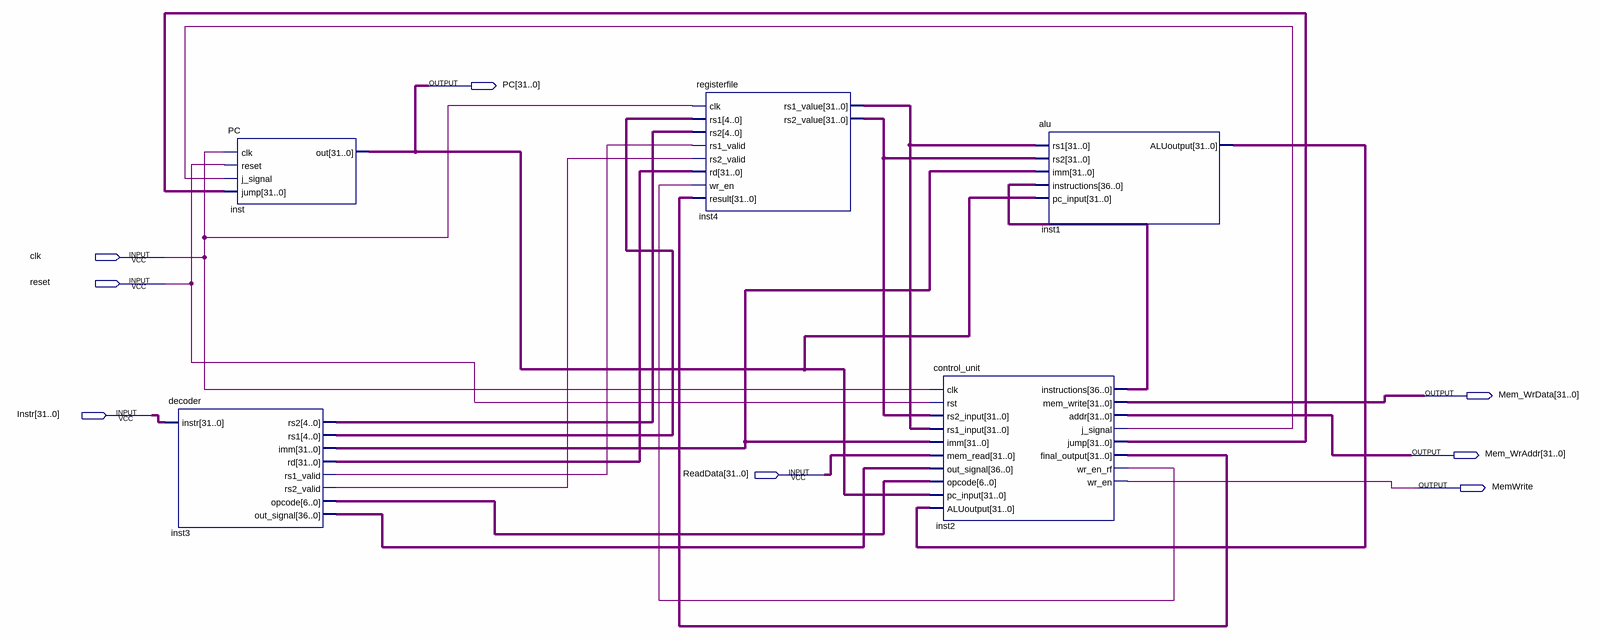
[diagram p0: schematic sheet]
// Quartus schematic riscv_cpu_block.bdf as structural Verilog: 5 symbols, 8 pins
module riscv_cpu_block (
  input  clk,
  input  reset,
  input  [31:0] Instr,
  input  [31:0] ReadData,
  output [31:0] PC,
  output [31:0] Mem_WrData,
  output [31:0] Mem_WrAddr,
  output MemWrite
);

  wire inst2_j_signal, inst2_wr_en_rf, inst3_rs1_valid, inst3_rs2_valid;
  wire [4:0] inst3_rs1, inst3_rs2;
  wire [6:0] inst3_opcode;
  wire [31:0] inst1_aluoutput, inst2_final_output, inst2_jump, inst3_imm, inst3_rd, inst4_rs1_value,
       inst4_rs2_value;
  wire [36:0] inst2_instructions, inst3_out_signal;

  decoder inst3 (
    .instr(Instr), .rs2(inst3_rs2), .rs1(inst3_rs1), .imm(inst3_imm), .rd(inst3_rd),
    .rs1_valid(inst3_rs1_valid), .rs2_valid(inst3_rs2_valid), .opcode(inst3_opcode),
    .out_signal(inst3_out_signal));
  PC inst (.clk(clk), .reset(reset), .j_signal(inst2_j_signal), .jump(inst2_jump), .out(PC));
  registerfile inst4 (
    .clk(clk), .rs1(inst3_rs1), .rs2(inst3_rs2), .rs1_valid(inst3_rs1_valid), .rs2_valid(inst3_rs2_valid),
    .rd(inst3_rd), .wr_en(inst2_wr_en_rf), .result(inst2_final_output), .rs1_value(inst4_rs1_value),
    .rs2_value(inst4_rs2_value));
  control_unit inst2 (
    .clk(clk), .rst(reset), .rs2_input(inst4_rs2_value), .rs1_input(inst4_rs1_value), .imm(inst3_imm),
    .mem_read(ReadData), .out_signal(inst3_out_signal), .opcode(inst3_opcode), .pc_input(PC),
    .ALUoutput(inst1_aluoutput), .instructions(inst2_instructions), .mem_write(Mem_WrData),
    .addr(Mem_WrAddr), .j_signal(inst2_j_signal), .jump(inst2_jump), .final_output(inst2_final_output),
    .wr_en_rf(inst2_wr_en_rf), .wr_en(MemWrite));
  alu inst1 (
    .rs1(inst4_rs1_value), .rs2(inst4_rs2_value), .imm(inst3_imm), .instructions(inst2_instructions),
    .pc_input(PC), .ALUoutput(inst1_aluoutput));
endmodule
